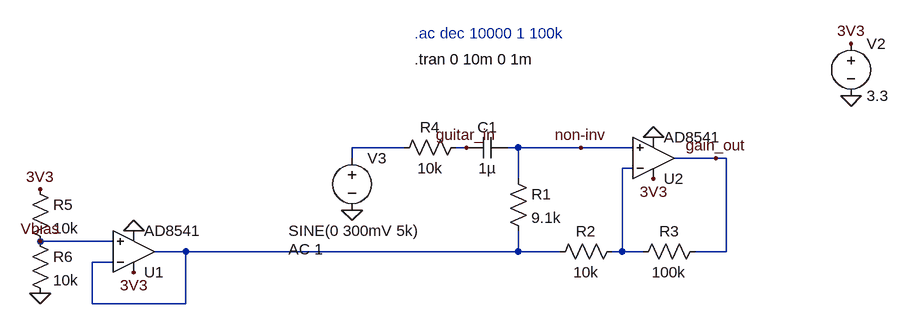
[diagram p0: schematic bias_amp_rx.asc]
bias_amp_rx.asc, the LTspice schematic file:
Version 4.1
SHEET 1 1152 680
WIRE -48 64 -128 64
WIRE 48 64 32 64
WIRE 128 64 112 64
WIRE 224 64 128 64
WIRE 304 64 224 64
WIRE -128 80 -128 64
WIRE 432 80 368 80
WIRE 448 80 432 80
WIRE 304 96 288 96
WIRE 128 112 128 64
WIRE -496 208 -608 208
WIRE -384 224 -432 224
WIRE 128 224 128 192
WIRE 128 224 -384 224
WIRE 192 224 128 224
WIRE 288 224 288 96
WIRE 288 224 272 224
WIRE 320 224 288 224
WIRE 448 224 448 80
WIRE 448 224 400 224
WIRE -496 240 -528 240
WIRE -528 304 -528 240
WIRE -384 304 -384 224
WIRE -384 304 -528 304
FLAG 432 80 gain_out
FLAG 336 112 3V3
FLAG 336 48 0
FLAG 48 64 guitar_in
FLAG -608 288 0
FLAG 640 -16 0
FLAG 640 -96 3V3
FLAG -128 160 0
FLAG -608 208 Vbias
FLAG -608 128 3V3
FLAG -464 256 3V3
FLAG -464 192 0
FLAG 224 64 non-inv
SYMBOL cap 112 48 R90
WINDOW 0 0 32 VBottom 2
WINDOW 3 32 32 VTop 2
SYMATTR InstName C1
SYMATTR Value 1µ
SYMBOL res 112 96 R0
SYMATTR InstName R1
SYMATTR Value 9.1k
SYMBOL res 288 208 R90
WINDOW 0 0 56 VBottom 2
WINDOW 3 32 56 VTop 2
SYMATTR InstName R2
SYMATTR Value 10k
SYMBOL res 416 208 R90
WINDOW 0 0 56 VBottom 2
WINDOW 3 32 56 VTop 2
SYMATTR InstName R3
SYMATTR Value 100k
SYMBOL voltage 640 -112 R0
SYMATTR InstName V2
SYMATTR Value 3.3
SYMBOL voltage -128 64 R0
WINDOW 3 -98 128 Left 2
WINDOW 123 -98 156 Left 2
WINDOW 39 0 0 Left 0
SYMATTR Value SINE(0 300mV 5k)
SYMATTR Value2 AC 1
SYMATTR InstName V3
SYMBOL res 48 48 R90
WINDOW 0 0 56 VBottom 2
WINDOW 3 32 56 VTop 2
SYMATTR InstName R4
SYMATTR Value 10k
SYMBOL OpAmps\\AD8541 336 144 M180
SYMATTR InstName U2
SYMBOL res -624 112 R0
SYMATTR InstName R5
SYMATTR Value 10k
SYMBOL res -624 192 R0
SYMATTR InstName R6
SYMATTR Value 10k
SYMBOL OpAmps\\AD8541 -464 288 M180
SYMATTR InstName U1
TEXT -32 -72 Left 2 !.tran 0 10m 0 1m
TEXT -32 -112 Left 2 ;.ac dec 10000 1 100k

The netlist it stands for:
* bias_amp_rx.asc
C1 non-inv guitar_in 1µ
R1 non-inv N003 9.1k
R2 N002 N003 10k
R3 gain_out N002 100k
V2 3V3 0 3.3
V3 N001 0 SINE(0 300mV 5k) AC 1
R4 guitar_in N001 10k
X§U2 non-inv N002 3V3 0 gain_out AD8541  ; pins In+ In- V+ V- OUT
R5 3V3 Vbias 10k
R6 Vbias 0 10k
X§U1 Vbias N003 3V3 0 N003 AD8541  ; pins In+ In- V+ V- OUT
.tran 0 10m 0 1m
* .ac dec 10000 1 100k
.backanno
.end